# Altium schematic sheet RF.SchDoc
size A4
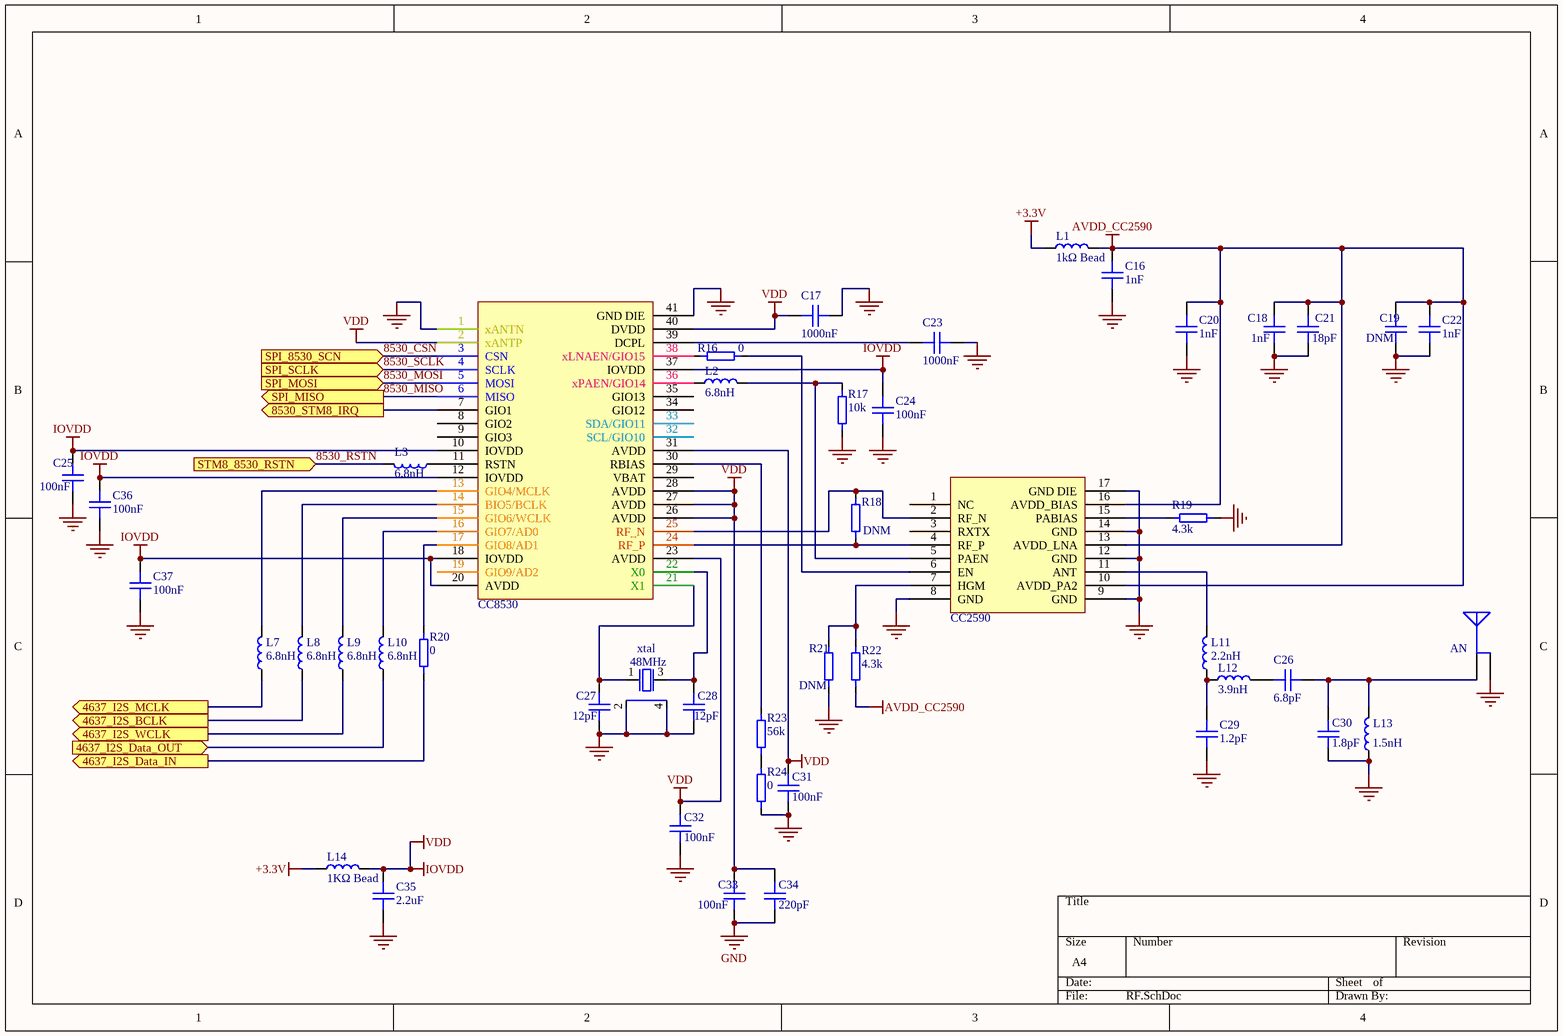
[diagram p0: RF.SchDoc]

## Parts
AN  Antenna  [ANT_WIGGLE_1MM]  (value not drawn)
C16  value 1nF  [SMD 0402]  (hidden comment: Capacity SMD)
C17  value 1000nF  [SMD 0402]  (hidden comment: Capacity SMD)
C18  value 1nF  [SMD 0402]  (hidden comment: Capacity SMD)
C19  value DNM  [SMD 0402]  (hidden comment: Capacity SMD)
C20  value 1nF  [SMD 0402]  (hidden comment: Capacity SMD)
C21  value 18pF  [SMD 0402]  (hidden comment: Capacity SMD)
C22  value 1nF  [SMD 0402]  (hidden comment: Capacity SMD)
C23  value 1000nF  [SMD 0402]  (hidden comment: Capacity SMD)
C24  value 100nF  [SMD 0402]  (hidden comment: Capacity SMD)
C25  value 100nF  [SMD 0402]  (hidden comment: Capacity SMD)
C26  value 6.8pF  [SMD 0402]  (hidden comment: Capacity SMD)
C27  value 12pF  [SMD 0402]  (hidden comment: Capacity SMD)
C28  value 12pF  [SMD 0402]  (hidden comment: Capacity SMD)
C29  value 1.2pF  [SMD 0402]  (hidden comment: Capacity SMD)
C30  value 1.8pF  [SMD 0402]  (hidden comment: Capacity SMD)
C31  value 100nF  [SMD 0402]  (hidden comment: Capacity SMD)
C32  value 100nF  [SMD 0402]  (hidden comment: Capacity SMD)
C33  value 100nF  [SMD 0402]  (hidden comment: Capacity SMD)
C34  value 220pF  [SMD 0402]  (hidden comment: Capacity SMD)
C35  value 2.2uF  [SMD 0402]  (hidden comment: Capacity SMD)
C36  value 100nF  [SMD 0402]  (hidden comment: Capacity SMD)
C37  value 100nF  [SMD 0402]  (hidden comment: Capacity SMD)
CC2590  CC2590  [CC2590]  (value not drawn)
CC8530  CC8530  [CC8530]  (value not drawn)
L1  value 1kΩ Bead  [SMD 0402]  (hidden comment: Inductor SMD)
L2  value 6.8nH  [SMD 0402]  (hidden comment: Inductor SMD)
L3  value 6.8nH  [SMD 0402]  (hidden comment: Inductor SMD)
L7  value 6.8nH  [SMD 0402]  (hidden comment: Inductor SMD)
L8  value 6.8nH  [SMD 0402]  (hidden comment: Inductor SMD)
L9  value 6.8nH  [SMD 0402]  (hidden comment: Inductor SMD)
L10  value 6.8nH  [SMD 0402]  (hidden comment: Inductor SMD)
L11  value 2.2nH  [SMD 0402]  (hidden comment: Inductor SMD)
L12  value 3.9nH  [SMD 0402]  (hidden comment: Inductor SMD)
L13  value 1.5nH  [SMD 0402]  (hidden comment: Inductor SMD)
L14  value 1KΩ Bead  [SMD 0402]  (hidden comment: Inductor SMD)
R16  value 0  [SMD 0402]  (hidden comment: Resistor SMD)
R17  value 10k  [SMD 0402]  (hidden comment: Resistor SMD)
R18  value DNM  [SMD 0402]  (hidden comment: Resistor SMD)
R19  value 4.3k  [SMD 0402]  (hidden comment: Resistor SMD)
R20  value 0  [SMD 0402]  (hidden comment: Resistor SMD)
R21  value DNM  [SMD 0402]  (hidden comment: Resistor SMD)
R22  value 4.3k  [SMD 0402]  (hidden comment: Resistor SMD)
R23  value 56k  [SMD 0402]  (hidden comment: Resistor SMD)
R24  value 0  [SMD 0402]  (hidden comment: Resistor SMD)
xtal  value 48MHz  [xtal_3225_FA-128]  (hidden comment: XTAL)

## Ports
4637_I2S_BCLK (out), 4637_I2S_Data_IN (out), 4637_I2S_Data_OUT (in), 4637_I2S_MCLK (out), 4637_I2S_WCLK (out), 8530_STM8_IRQ (out), SPI_8530_SCN (in), SPI_MISO (out), SPI_MOSI (in), SPI_SCLK (in), STM8_8530_RSTN (in)

## Nets
+3.3V: L1.1 L14.1
AVDD_CC2590: C16.2 C18.2 C19.2 C20.2 C21.2 C22.2 CC2590.10(AVDD_PA2) CC2590.13(AVDD_LNA) CC2590.16(AVDD_BIAS) L1.2 R22.1
GND: AN.2 C16.1 C17.2 C18.1 C19.1 C20.1 C21.1 C22.1 C23.2 C24.1 C25.1 C27.1 C28.1 C29.1 C30.1 C31.1 C32.1 C33.1 C34.1 C35.1 C36.1 C37.1 CC2590.8(GND) CC2590.9(GND) CC2590.12(GND) CC2590.14(GND) CC2590.17(GND_DIE) CC8530.1(xANTN) CC8530.41(GND_DIE) L13.1 R17.1 R19.2 R21.1 R24.1 xtal.2(GND) xtal.4(GND)
IOVDD: C17.1 C24.2 C25.2 C31.2 C32.2 C33.2 C34.2 C35.2 C36.2 C37.2 CC8530.2(xANTP) CC8530.10(IOVDD) CC8530.12(IOVDD) CC8530.18(IOVDD) CC8530.20(AVDD) CC8530.23(AVDD) CC8530.26(AVDD) CC8530.27(AVDD) CC8530.28(AVDD) CC8530.31(AVDD) CC8530.37(IOVDD) CC8530.40(DVDD) L14.2  [also labelled VDD]
4637_I2S_BCLK: L8.1 ; port 4637_I2S_BCLK
4637_I2S_Data_IN: R20.1 ; port 4637_I2S_Data_IN
4637_I2S_Data_OUT: L10.1 ; port 4637_I2S_Data_OUT
4637_I2S_MCLK: L7.1 ; port 4637_I2S_MCLK
4637_I2S_WCLK: L9.1 ; port 4637_I2S_WCLK
8530_CSN: CC8530.3(CSN) ; port SPI_8530_SCN
8530_MISO: CC8530.6(MISO) ; port SPI_MISO
8530_MOSI: CC8530.5(MOSI) ; port SPI_MOSI
8530_RSTN: L3.2 ; port STM8_8530_RSTN
8530_SCLK: CC8530.4(SCLK) ; port SPI_SCLK
8530_STM8_IRQ: CC8530.7(GIO1) ; port 8530_STM8_IRQ
NetAN_1: AN.1 C26.2 C30.2 L13.2
NetC23_1: C23.1 CC8530.39(DCPL)
NetC26_1: C26.1 L12.2
NetC27_2: C27.2 CC8530.21(X1) xtal.1(inp)
NetC28_2: C28.2 CC8530.22(X0) xtal.3(out)
NetC29_2: C29.2 L11.1 L12.1
NetCC2590_2: CC2590.2(RF_N) CC8530.25(RF_N) R18.2
NetCC2590_4: CC2590.4(RF_P) CC8530.24(RF_P) R18.1
NetCC2590_5: CC2590.5(PAEN) L2.2 R17.2
NetCC2590_6: CC2590.6(EN) R16.2
NetCC2590_7: CC2590.7(HGM) R21.2 R22.2
NetCC2590_11: CC2590.11(ANT) L11.2
NetCC2590_15: CC2590.15(PABIAS) R19.1
NetCC8530_11: CC8530.11(RSTN) L3.1
NetCC8530_13: CC8530.13(GIO4/MCLK) L7.2
NetCC8530_14: CC8530.14(BIO5/BCLK) L8.2
NetCC8530_15: CC8530.15(GIO6/WCLK) L9.2
NetCC8530_16: CC8530.16(GIO7/AD0) L10.2
NetCC8530_17: CC8530.17(GIO8/AD1) R20.2
NetCC8530_30: CC8530.30(RBIAS) R23.2
NetCC8530_36: CC8530.36(xPAEN/GIO14) L2.1
NetCC8530_38: CC8530.38(xLNAEN/GIO15) R16.1
NetR23_1: R23.1 R24.2

Not connected (* = marked no-connect by the designer): CC2590 1(NC) 3(RXTX); CC8530 8(GIO2) 9(GIO3) 19(GIO9/AD2) 29(VBAT) 32(SCL/GIO10) 33(SDA/GIO11) 34(GIO12) 35(GIO13)

## Library data of the parts
xtal = XTAL: Part Number: FA-128, 48.00000MHz; Footprint: BT-XTAL_3225
CC2590 = CC2590: FootPrint: 16-Pin QFN
CC8530 = CC8530: FootPrint: 40-Pin QFN